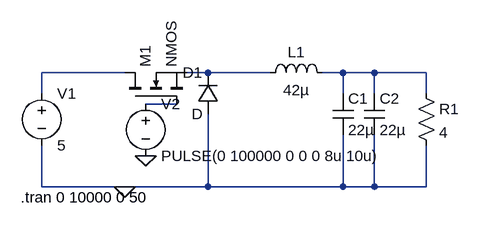
[diagram p0: schematic Buck.asc]
Buck.asc, the LTspice schematic file:
Version 4.1
SHEET 1 880 680
WIRE 32 -32 -96 -32
WIRE 160 -32 128 -32
WIRE 256 -32 160 -32
WIRE 368 -32 336 -32
WIRE 416 -32 368 -32
WIRE 496 -32 416 -32
WIRE -96 0 -96 -32
WIRE 368 0 368 -32
WIRE 416 0 416 -32
WIRE 496 0 496 -32
WIRE 112 16 64 16
WIRE -96 144 -96 80
WIRE 32 144 -96 144
WIRE 160 144 160 32
WIRE 160 144 32 144
WIRE 368 144 368 64
WIRE 368 144 160 144
WIRE 416 144 416 64
WIRE 416 144 368 144
WIRE 496 144 496 80
WIRE 496 144 416 144
FLAG 32 144 0
FLAG 64 96 0
SYMBOL voltage -96 -16 R0
WINDOW 123 0 0 Left 0
WINDOW 39 0 0 Left 0
SYMATTR InstName V1
SYMATTR Value 5
SYMBOL nmos 32 16 R270
SYMATTR InstName M1
SYMBOL ind 240 -16 R270
WINDOW 0 32 56 VTop 2
WINDOW 3 5 56 VBottom 2
SYMATTR InstName L1
SYMATTR Value 42µ
SYMBOL res 480 -16 R0
SYMATTR InstName R1
SYMATTR Value 4
SYMBOL cap 352 0 R0
SYMATTR InstName C1
SYMATTR Value 22µ
SYMBOL cap 400 0 R0
SYMATTR InstName C2
SYMATTR Value 22µ
SYMBOL diode 176 32 R180
WINDOW 0 24 64 Left 2
WINDOW 3 24 0 Left 2
SYMATTR InstName D1
SYMBOL voltage 64 0 R0
WINDOW 123 0 0 Left 0
WINDOW 39 0 0 Left 0
SYMATTR InstName V2
SYMATTR Value PULSE(0 100000 0 0 0 8u 10u)
TEXT -128 160 Left 2 !.tran 0 10000 0 50

The netlist it stands for:
* Buck.asc
V1 N001 0 5
M1 N001 N004 N002 N002 NMOS
L1 N002 N003 42µ
R1 N003 0 4
C1 N003 0 22µ
C2 N003 0 22µ
D1 0 N002 D
V2 N004 0 PULSE(0 100000 0 0 0 8u 10u)
.model D D
.lib standard.dio
.model NMOS NMOS
.model PMOS PMOS
.lib standard.mos
.tran 0 10000 0 50
.backanno
.end